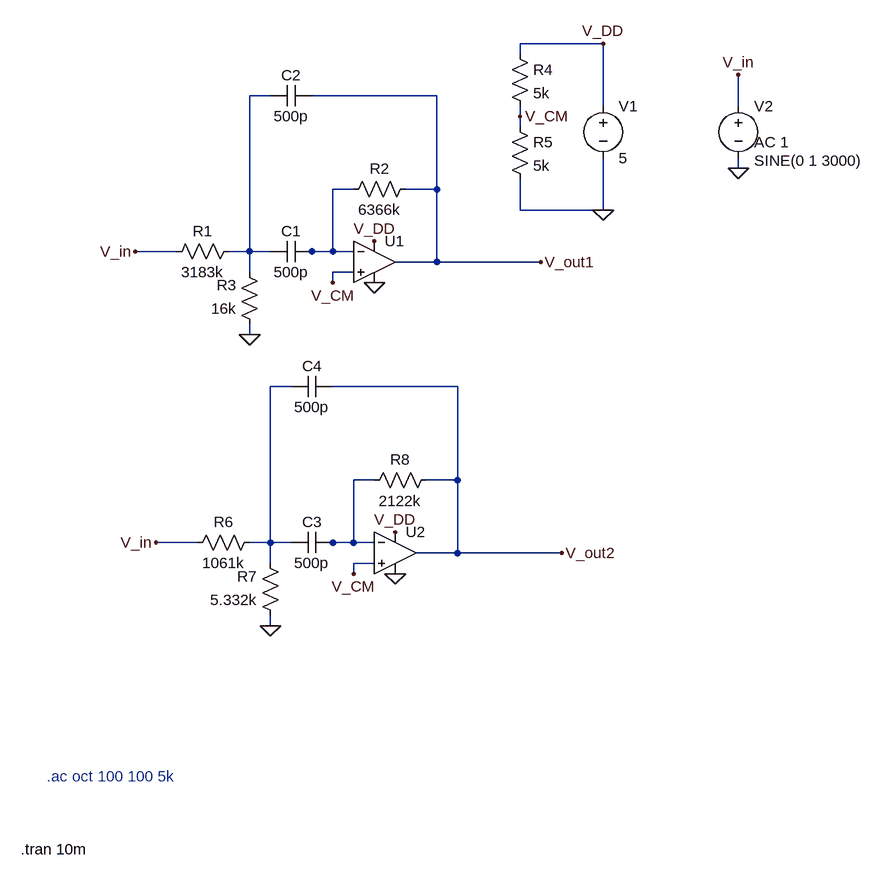
[diagram p0: schematic bpf.asc]
bpf.asc, the LTspice schematic file:
Version 4
SHEET 1 1088 1032
WIRE 672 -224 544 -224
WIRE 544 -208 544 -224
WIRE 160 -144 128 -144
WIRE 416 -144 224 -144
WIRE 672 -128 672 -224
WIRE 880 -128 880 -176
WIRE 544 -112 544 -128
WIRE 544 -96 544 -112
WIRE 880 -32 880 -48
WIRE 288 0 256 0
WIRE 416 0 416 -144
WIRE 416 0 368 0
WIRE 544 32 544 -16
WIRE 672 32 672 -48
WIRE 672 32 544 32
WIRE 16 96 -48 96
WIRE 128 96 128 -144
WIRE 128 96 96 96
WIRE 160 96 128 96
WIRE 224 96 208 96
WIRE 256 96 256 0
WIRE 256 96 224 96
WIRE 288 96 256 96
WIRE 416 112 416 0
WIRE 416 112 352 112
WIRE 576 112 416 112
WIRE 128 128 128 96
WIRE 288 128 256 128
WIRE 256 144 256 128
WIRE 128 224 128 208
WIRE 192 304 160 304
WIRE 448 304 256 304
WIRE 320 448 288 448
WIRE 448 448 448 304
WIRE 448 448 400 448
WIRE 48 544 -16 544
WIRE 160 544 160 304
WIRE 160 544 128 544
WIRE 192 544 160 544
WIRE 256 544 240 544
WIRE 288 544 288 448
WIRE 288 544 256 544
WIRE 320 544 288 544
WIRE 448 560 448 448
WIRE 448 560 384 560
WIRE 608 560 448 560
WIRE 160 576 160 544
WIRE 320 576 288 576
WIRE 288 592 288 576
WIRE 160 672 160 656
FLAG 128 224 0
FLAG 672 32 0
FLAG 672 -224 V_DD
FLAG 320 80 V_DD
FLAG 544 -112 V_CM
FLAG 256 144 V_CM
FLAG 320 144 0
FLAG 576 112 V_out1
FLAG -48 96 V_in
FLAG 880 -32 0
FLAG 880 -176 V_in
FLAG 160 672 0
FLAG 352 528 V_DD
FLAG 288 592 V_CM
FLAG 352 592 0
FLAG 608 560 V_out2
FLAG -16 544 V_in
SYMBOL res 112 80 R90
WINDOW 0 0 56 VBottom 2
WINDOW 3 32 56 VTop 2
SYMATTR InstName R1
SYMATTR Value 3183k
SYMBOL res 144 224 R180
WINDOW 0 36 76 Left 2
WINDOW 3 36 40 Left 2
SYMATTR InstName R3
SYMATTR Value 16k
SYMBOL res 272 16 R270
WINDOW 0 32 56 VTop 2
WINDOW 3 0 56 VBottom 2
SYMATTR InstName R2
SYMATTR Value 6366k
SYMBOL cap 224 80 R90
WINDOW 0 0 32 VBottom 2
WINDOW 3 32 32 VTop 2
SYMATTR InstName C1
SYMATTR Value 500p
SYMBOL cap 224 -160 R90
WINDOW 0 0 32 VBottom 2
WINDOW 3 32 32 VTop 2
SYMATTR InstName C2
SYMATTR Value 500p
SYMBOL voltage 672 -144 R0
WINDOW 123 0 0 Left 0
WINDOW 39 0 0 Left 0
SYMATTR InstName V1
SYMATTR Value 5
SYMBOL voltage 880 -144 R0
WINDOW 3 24 100 Left 2
WINDOW 123 24 72 Left 2
WINDOW 39 0 0 Left 0
SYMATTR Value SINE(0 1 3000)
SYMATTR Value2 AC 1
SYMATTR InstName V2
SYMBOL res 528 -224 R0
SYMATTR InstName R4
SYMATTR Value 5k
SYMBOL res 528 -112 R0
SYMATTR InstName R5
SYMATTR Value 5k
SYMBOL Opamps\\UniversalOpamp2 320 112 R0
SYMATTR InstName U1
SYMBOL res 144 528 R90
WINDOW 0 0 56 VBottom 2
WINDOW 3 32 56 VTop 2
SYMATTR InstName R6
SYMATTR Value 1061k
SYMBOL res 176 672 R180
WINDOW 0 36 76 Left 2
WINDOW 3 36 40 Left 2
SYMATTR InstName R7
SYMATTR Value 5.332k
SYMBOL res 304 464 R270
WINDOW 0 32 56 VTop 2
WINDOW 3 0 56 VBottom 2
SYMATTR InstName R8
SYMATTR Value 2122k
SYMBOL cap 256 528 R90
WINDOW 0 0 32 VBottom 2
WINDOW 3 32 32 VTop 2
SYMATTR InstName C3
SYMATTR Value 500p
SYMBOL cap 256 288 R90
WINDOW 0 0 32 VBottom 2
WINDOW 3 32 32 VTop 2
SYMATTR InstName C4
SYMATTR Value 500p
SYMBOL Opamps\\UniversalOpamp2 352 560 R0
SYMATTR InstName U2
TEXT -224 1016 Left 2 !.tran 10m
TEXT -184 904 Left 2 ;.ac oct 100 100 5k

The netlist it stands for:
* bpf.asc
R1 N001 V_in 3183k
R3 0 N001 16k
R2 N002 V_out1 6366k
C1 N002 N001 500p
C2 V_out1 N001 500p
V1 V_DD 0 5
V2 V_in 0 SINE(0 1 3000) AC 1
R4 V_DD V_CM 5k
R5 V_CM 0 5k
XU1 V_CM N002 V_DD 0 V_out1 level.2 Avol=1Meg GBW=10Meg Slew=10Meg ilimit=25m rail=0 Vos=0 phimargin=45 en=0 enk=0 in=0 ink=0 Rin=500Meg  ; pins IN+ IN- V+ V- OUT
R6 N003 V_in 1061k
R7 0 N003 5.332k
R8 N004 V_out2 2122k
C3 N004 N003 500p
C4 V_out2 N003 500p
XU2 V_CM N004 V_DD 0 V_out2 level.2 Avol=1Meg GBW=10Meg Slew=10Meg ilimit=25m rail=0 Vos=0 phimargin=45 en=0 enk=0 in=0 ink=0 Rin=500Meg  ; pins IN+ IN- V+ V- OUT
.tran 10m
* .ac oct 100 100 5k
.lib UniversalOpamps2.sub
.backanno
.end